# Altium schematic sheet Output Amplifier.SchDoc
size 406 x 304 mm; SheetNumber: 8; SheetTotal: 8
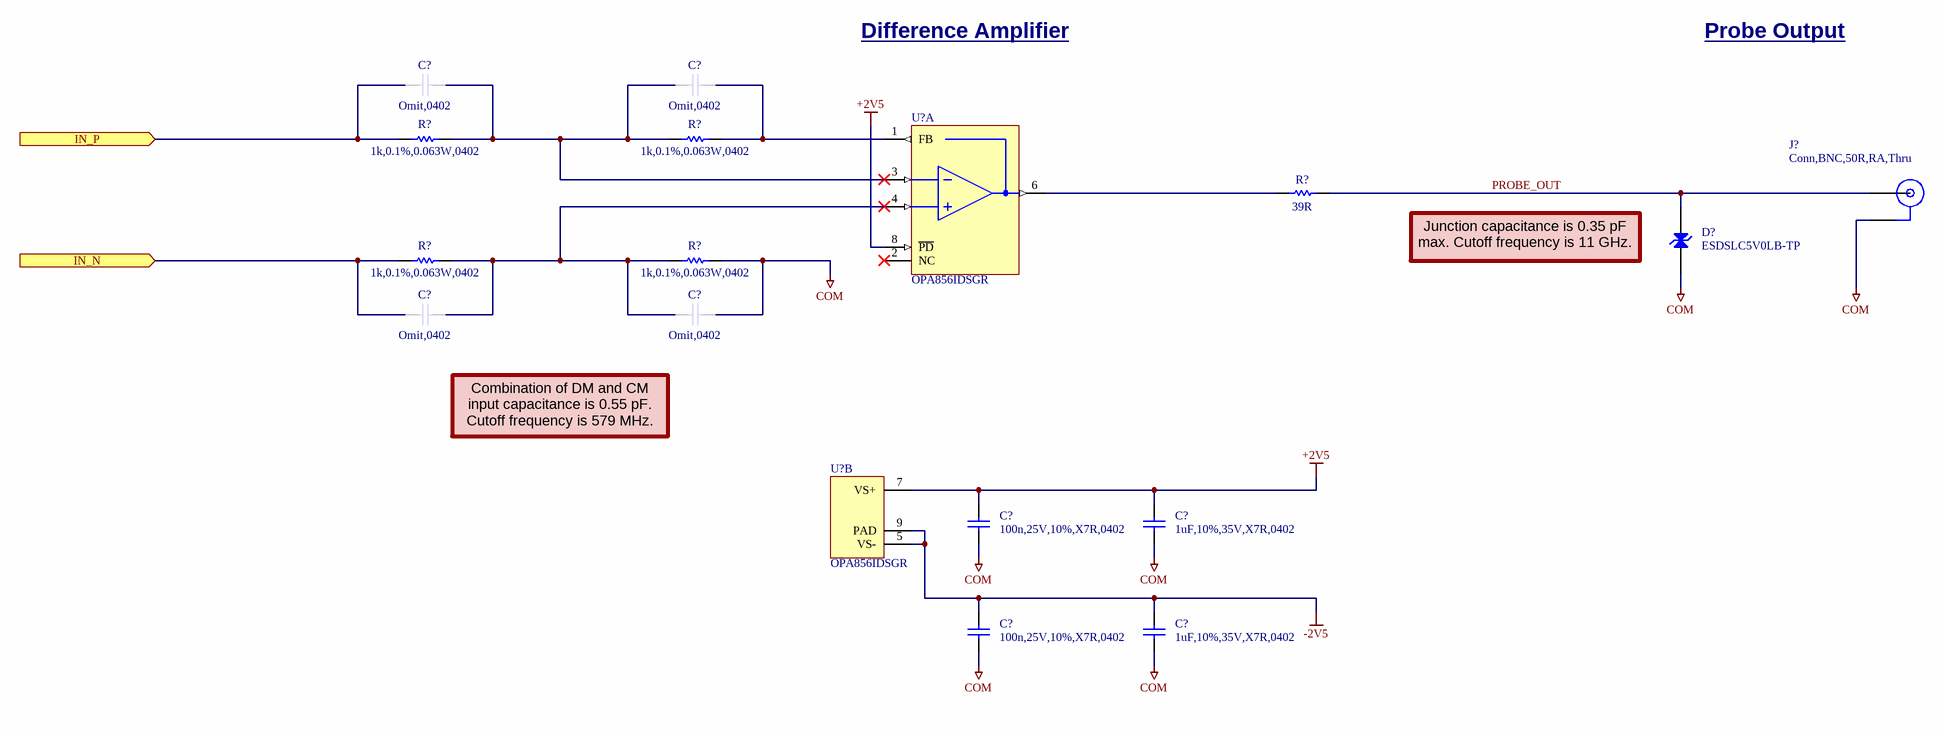
[diagram p0: Output Amplifier.SchDoc]

## Parts
(Parts that share a designator on the sheet are numbered #1, #2 ... from top to bottom, then left to right.)
C?#1  Omit,0402  [CAPC1005X06N]  (no BOM)
C?#2  Omit,0402  [CAPC1005X06N]  (no BOM)
C?#3  Omit,0402  [CAPC1005X06N]  (no BOM)
C?#4  Omit,0402  [CAPC1005X06N]  (no BOM)
C?#5  100n,25V,10%,X7R,0402  [CAPC1005X06N]
C?#6  1uF,10%,35V,X7R,0402  [CAPC1005X06N]
C?#7  100n,25V,10%,X7R,0402  [CAPC1005X06N]
C?#8  1uF,10%,35V,X7R,0402  [CAPC1005X06N]
D?  ESDSLC5V0LB-TP  [MICROCOMMERCIAL_DFN1006-2_NPOL]
J?  Conn,BNC,50R,RA,Thru  [TE-CONNECTIVITY_CONBNC002]
R?#1  1k,0.1%,0.063W,0402  [RESC1005X04N]
R?#2  1k,0.1%,0.063W,0402  [RESC1005X04N]
R?#3  39R  [RESC1005X04N]
R?#4  1k,0.1%,0.063W,0402  [RESC1005X04N]
R?#5  1k,0.1%,0.063W,0402  [RESC1005X04N]
U?#1  OPA856IDSGR  [TEXASINSTRUMENTS_PKG_DSG0008A]  (part A of 2)
U?#2  OPA856IDSGR  [TEXASINSTRUMENTS_PKG_DSG0008A]  (part B of 2)

## Ports
IN_N (in), IN_P (in)

## Nets
+2V5: C?#5.2 C?#6.2 U?#1.8(~{PD}) U?#2.7(VS+)
-2V5: C?#7.2 C?#8.2 U?#2.5(VS-) U?#2.9(PAD)
COM: C?#4.1 C?#5.1 C?#6.1 C?#7.1 C?#8.1 D?.2(A) J?.2 R?#5.2
IN_N: C?#3.2 R?#4.1 ; port IN_N
IN_P: C?#1.2 R?#1.1 ; port IN_P
PROBE_OUT: D?.1(K) J?.1 R?#3.2
NetC?#1_1: C?#1.1 C?#2.2 R?#1.2 R?#2.1 U?#1.3(IN-)
NetC?#2_1: C?#2.1 R?#2.2 U?#1.1(FB)
NetC?#3_1: C?#3.1 C?#4.2 R?#4.2 R?#5.1 U?#1.4(IN+)
NetR?#3_1: R?#3.1 U?#1.6(OUT)

Not connected (* = marked no-connect by the designer): U?#1 2(NC)*

## Notes on the sheet
- Difference Amplifier
- Probe Output
- (near D?) Junction capacitance is 0.35 pF max. Cutoff frequency is 11 GHz.
- Combination of DM and CM input capacitance is 0.55 pF. Cutoff frequency is 579 MHz.
- Sheet Name:
- Date:
- Sheet
- Designer:
- of

## Library data of the parts
C?#1-C?#4 = CAP,Omit,0402: Omit; Part Name: CAP,Omit,0402; CreatedBy: Judd Foster; HelpURL: N/A; Manufacturer 1: N/A; Manufacturer 1 Part Number: N/A; Vendor 1: N/A; Vendor 1 Part Number: N/A; Value: Omit
C?#5 C?#7 = CAP,Cer,100nF,10%,25VDC,X7R,0402: 0.1ï¿½F ï¿½10% 25V Ceramic Capacitor X7R 0402 (1005 Metric); Manufacturer 1: Murata Electronics; Manufacturer 1 Part Number: GRM155R71E104KE14J; Vendor 1 Part Number: 490-14603-1-ND; Vendor 1: DigiKey; Value: 100nF; Part Name: CAP,Cer,100nF,10%,25VDC,X7R,0402; CreatedBy: Judd Foster; HelpURL: https://search.murata.co.jp/Ceramy/image/img/A01X/G101/ENG/GRM155R71E104KE14-01.pdf
C?#6 C?#8 = CAP,Cer,1uF,35VDC,X5R,0402: 1 ï¿½F ï¿½10% 35V Ceramic Capacitor X5R 0402 (1005 Metric); Manufacturer 1: TDK Corporation; Manufacturer 1 Part Number: C1005X5R1V105K050BC; Vendor 1 Part Number: 445-9073-1-ND; Vendor 1: Digikey; Value: 1u; Part Name: CAP,Cer,1uF,35VDC,X5R,0402; CreatedBy: Judd Foster; HelpURL: https://product.tdk.com/info/en/catalog/datasheets/mlcc_commercial_general_en.pdf?ref_disty=digikey
D? = DIODE,TVS,5.0V,SOD882: 20V Clamp 4A (8/20ï¿½s) Ipp Tvs Diode Surface Mount 2-DFN1006; Manufacturer 1: Micro Commercial Co; Vendor 1 Part Number: ESDSLC5V0LB-TPMSCT-ND; Vendor 1: Digikey; Part Name: DIODE,TVS,5.0V,SOD882; CreatedBy: Judd Foster; HelpURL: https://www.mccsemi.com/pdf/Products/ESDSLC5V0LB(DFN1006-2).pdf; Manufacturer 1 Part Number: ESDSLC5V0LB-TP
J? = Conn,BNC,50R,RA,Thru: BNC Connector Jack, Female Socket 50 Ohms Panel Mount, Through Hole, Right Angle Solder; Manufacturer 1: TE Connectivity Linx; Manufacturer 1 Part Number: CONBNC002; Vendor 1 Part Number: 343-CONBNC002-ND; Vendor 1: DigiKey; Part Name: Conn,BNC,50R,RA,Thru; CreatedBy: Judd Foster; HelpURL: https://www.te.com/commerce/DocumentDelivery/DDEController?Action=srchrtrv&DocNm=CONBNC002&DocType=Data+Sheet&DocLang=English&DocFormat=pdf&PartCntxt=CONBNC002
R?#1 R?#2 R?#4 R?#5 = RES,1k,0.1%,0.063W,0402: 1 kOhms Â±0.1% 0.063W, 1/16W Chip Resistor 0402 (1005 Metric) Thin Film; Manufacturer 1: YAGEO; Manufacturer 1 Part Number: RT0402BRE071KL; Vendor 1 Part Number: YAG2306CT-ND; Vendor 1: DigiKey; Part Name: RES,1k,0.1%,0.063W,0402; CreatedBy: Judd Foster; HelpURL: https://www.yageo.com/upload/media/product/app/datasheet/rchip/pyu-rt_1-to-0.01_rohs_l.pdf; Value: 1k
R?#3 = RES,39R,1%,0.063W,0402: 39 Ohms ï¿½1% 0.063W, 1/16W Chip Resistor 0402 (1005 Metric) Moisture Resistant Thick Film; Manufacturer 1: YAGEO; Manufacturer 1 Part Number: RC0402FR-0739RL; Vendor 1 Part Number: 311-39.0LRCT-ND; Vendor 1: Digikey; Part Name: RES,39R,1%,0.063W,0402; CreatedBy: Judd Foster; HelpURL: https://www.yageo.com/upload/media/product/productsearch/datasheet/rchip/PYu-RC_Group_51_RoHS_L_12.pdf; Value: 39R
U?#1 U?#2 = OPA856IDSGR: General Purpose Amplifier 1 Circuit Rail-to-Rail 8-WSON (2x2); Manufacturer 1: Texas Instruments; Vendor 1 Part Number: 296-OPA856IDSGRCT-ND; Vendor 1: DigiKey; Part Name: OPA856IDSGR; CreatedBy: Judd Foster; HelpURL: https://www.ti.com/lit/ds/symlink/opa856.pdf?HQS=dis-dk-null-digikeymode-dsf-pf-null-wwe&ts=1736226484393; Manufacturer 1 Part Number: OPA856IDSGR